# EAGLE board sam9g25 (EAGLE 7.2.0)
SAM9G25 Embedded Linux Board Copyright (C) 2015 Andreas Auer (aauer1@emicrotec.at) This program is free software; you can redistribute it and/or modify it under the terms of the GNU General Public License as published by the Free Software Foundation; either version 2 of the License, or (at your option) any later version. This program is distributed in the hope that it will be useful, but WITHOUT ANY WARRANTY; without even the implied warranty of MERCHANTABILITY or FITNESS FOR A PARTICULAR PURPOSE. See the GNU General Public License for more details. You should have received a copy of the GNU General Public License along with this program; if not, write to the Free Software Foundation, Inc., 51 Franklin Street, Fifth Floor, Boston, MA 02110-1301 USA.
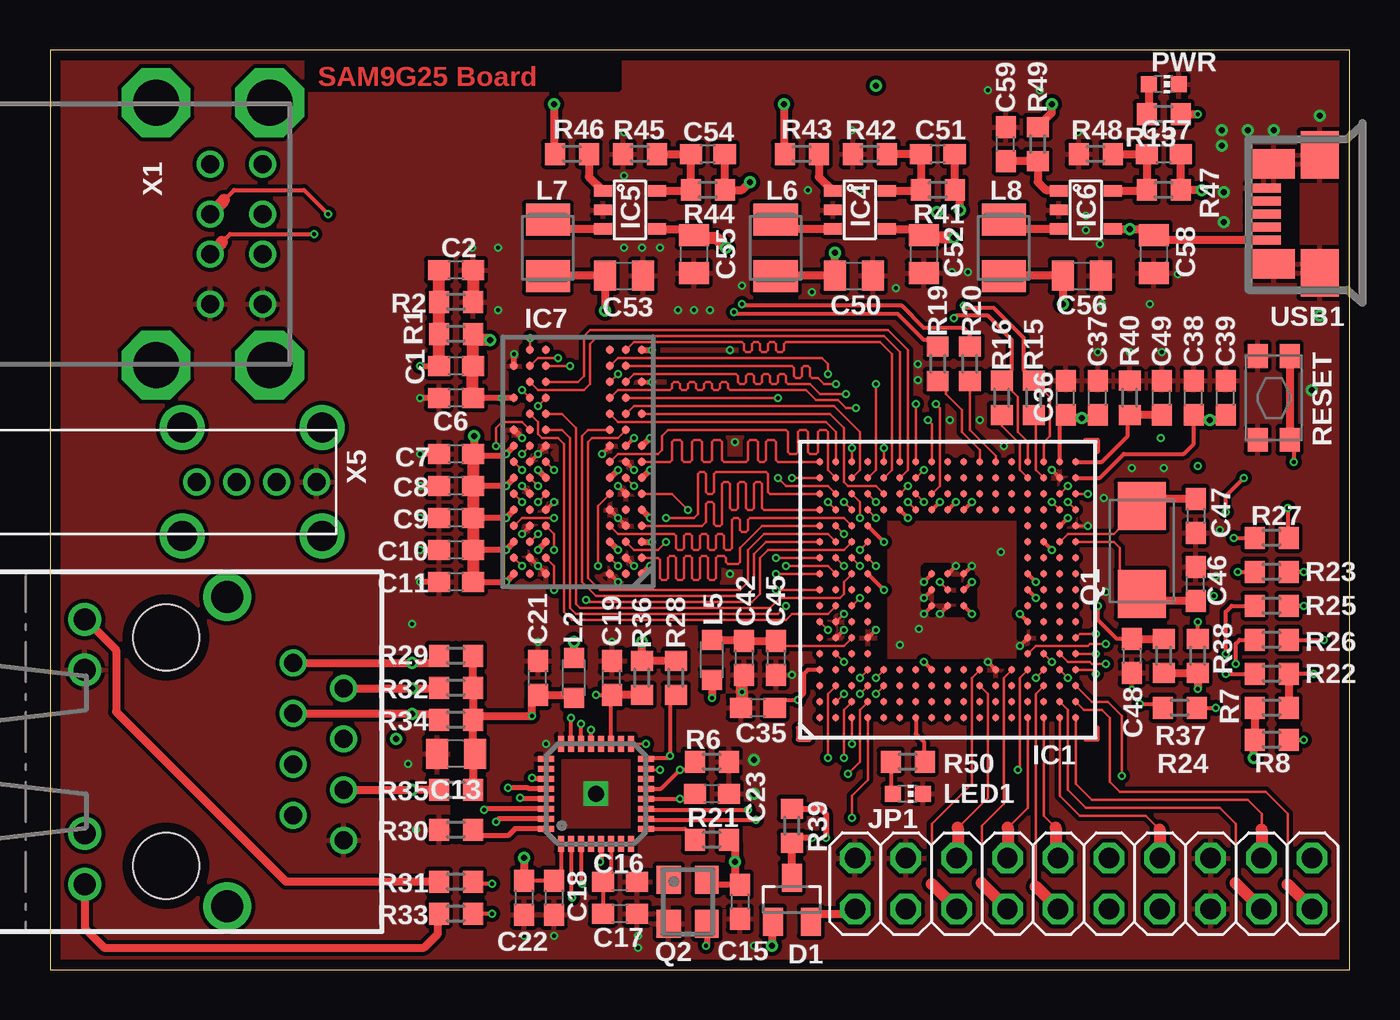
[diagram p3: board, top side]
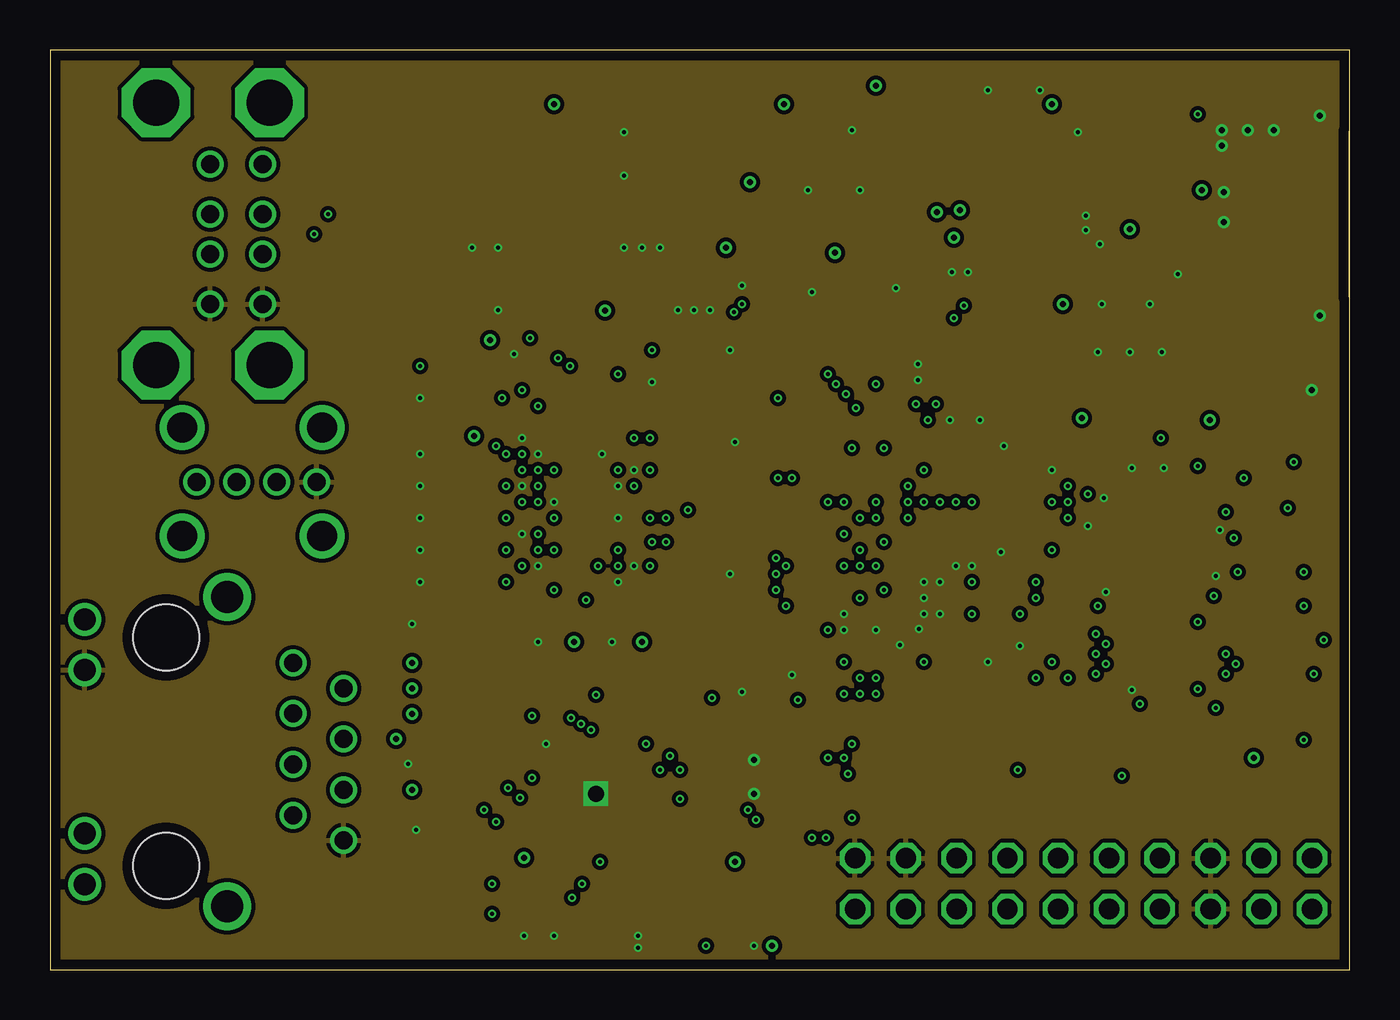
[diagram p4: board, inner layer Route2]
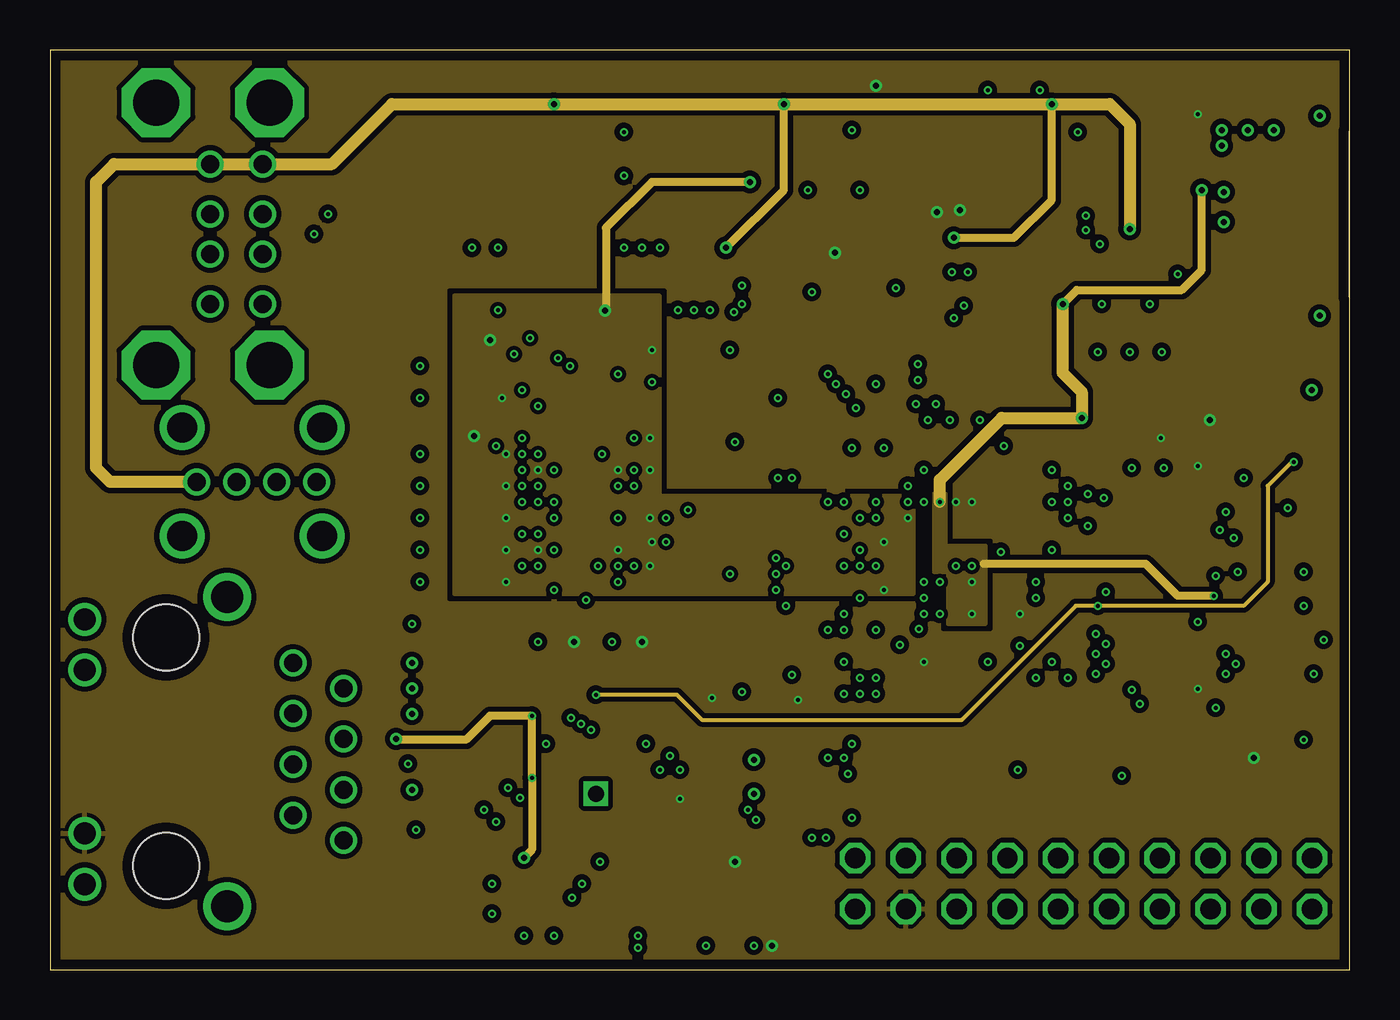
[diagram p5: board, inner layer Route15]
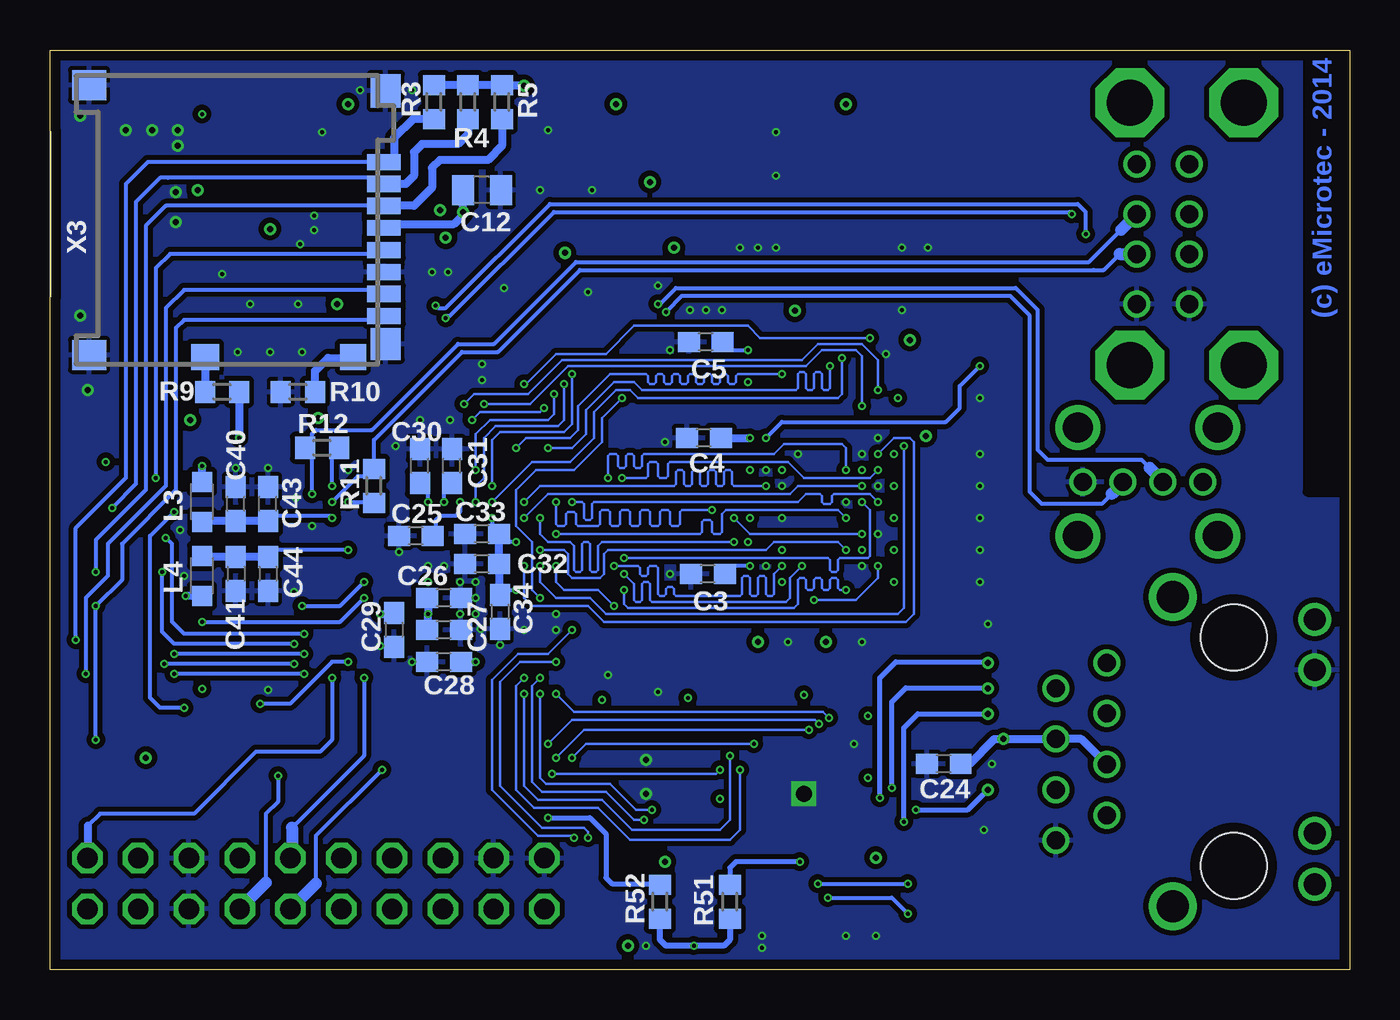
[diagram p6: board, bottom side, seen from below]

Size 65 x 46 mm. Coordinates in mm from the lower left corner, seen from the top.
Outline: 0,0 65,0 65,46 0,46 0,0
Copper layers (1+(2*15)+16): Top 0.035mm / dielectric 0.4mm / Route2 0.035mm / dielectric 0.7mm / Route15 0.035mm / dielectric 0.4mm / Bottom 0.035mm
Design rules "my_multi-cb_035um-cu *": minimum track width 0.125mm, minimum drill 0.2mm, track to track 0.125mm, track to pad 0.125mm, pad to pad 0.125mm, via to via 0.125mm, smd to smd 0.1mm, copper to edge 20mil, drill to drill 8mil, minimum pad ring 8mil, minimum via ring 0.1mm, stop-mask expansion 0.75mm, vias tented up to drill 0.2mm, thermal gap 8mil
tRestrict: 41 lines
bRestrict: 6 lines

## Footprints (pad centres in the part's own frame; a part is rotated, then mirrored left to right if it is on the bottom)
C0603 = smd 1.1 x 1: 1 -0.85,0; 2 0.85,0
C0805 = smd 1.1 x 1.5: 1 -0.95,0; 2 0.95,0
SOT23 = smd 1 x 1.4: 1 -0.95,-1.1; 2 0.95,-1.1; 3 0,1.1
LFBGA217 = smd 0.34 x 0.34: A1 -6.4,6.4; A2 -5.6,6.4; A3 -4.8,6.4; A4 -4,6.4; A5 -3.2,6.4; A6 -2.4,6.4; A7 -1.6,6.4; A8 -0.8,6.4; A9 0,6.4; A10 0.8,6.4; A11 1.6,6.4; A12 2.4,6.4; A13 3.2,6.4; A14 4,6.4; A15 4.8,6.4; A16 5.6,6.4; A17 6.4,6.4; B1 -6.4,5.6; B2 -5.6,5.6; B3 -4.8,5.6; B4 -4,5.6; B5 -3.2,5.6; B6 -2.4,5.6; B7 -1.6,5.6; B8 -0.8,5.6; B9 0,5.6; B10 0.8,5.6; B11 1.6,5.6; B12 2.4,5.6; B13 3.2,5.6; B14 4,5.6; B15 4.8,5.6; B16 5.6,5.6; B17 6.4,5.6; C1 -6.4,4.8; C2 -5.6,4.8; C3 -4.8,4.8; C4 -4,4.8; C5 -3.2,4.8; C6 -2.4,4.8; C7 -1.6,4.8; C8 -0.8,4.8; C9 0,4.8; C10 0.8,4.8; C11 1.6,4.8; C12 2.4,4.8; C13 3.2,4.8; C14 4,4.8; C15 4.8,4.8; C16 5.6,4.8; C17 6.4,4.8; D1 -6.4,4; D2 -5.6,4; D3 -4.8,4; D4 -4,4; D5 -3.2,4; D6 -2.4,4; D7 -1.6,4; D8 -0.8,4; D9 0,4; D10 0.8,4; D11 1.6,4; D12 2.4,4; D13 3.2,4; D14 4,4; D15 4.8,4; D16 5.6,4; D17 6.4,4; E1 -6.4,3.2; E2 -5.6,3.2; E3 -4.8,3.2; E4 -4,3.2; E14 4,3.2; E15 4.8,3.2; E16 5.6,3.2; E17 6.4,3.2; F1 -6.4,2.4; F2 -5.6,2.4; F3 -4.8,2.4; F4 -4,2.4; F14 4,2.4; F15 4.8,2.4; F16 5.6,2.4; F17 6.4,2.4; G1 -6.4,1.6; G2 -5.6,1.6; G3 -4.8,1.6; G4 -4,1.6; G14 4,1.6; G15 4.8,1.6; G16 5.6,1.6; G17 6.4,1.6; H1 -6.4,0.8; H2 -5.6,0.8; H3 -4.8,0.8; H4 -4,0.8; H8 -0.8,0.8; H9 0,0.8; H10 0.8,0.8; H14 4,0.8; H15 4.8,0.8; H16 5.6,0.8; H17 6.4,0.8; J1 -6.4,0; J2 -5.6,0; J3 -4.8,0; J4 -4,0; J8 -0.8,0; J9 0,0; J10 0.8,0; J14 4,0; J15 4.8,0; J16 5.6,0; J17 6.4,0; K1 -6.4,-0.8; K2 -5.6,-0.8; K3 -4.8,-0.8; K4 -4,-0.8; K8 -0.8,-0.8; K9 0,-0.8; K10 0.8,-0.8; K14 4,-0.8; K15 4.8,-0.8; K16 5.6,-0.8; K17 6.4,-0.8; L1 -6.4,-1.6; L2 -5.6,-1.6; L3 -4.8,-1.6; L4 -4,-1.6; L14 4,-1.6; L15 4.8,-1.6; L16 5.6,-1.6; L17 6.4,-1.6; M1 -6.4,-2.4; M2 -5.6,-2.4; M3 -4.8,-2.4; M4 -4,-2.4; M14 4,-2.4; M15 4.8,-2.4; M16 5.6,-2.4; M17 6.4,-2.4; N1 -6.4,-3.2; N2 -5.6,-3.2; N3 -4.8,-3.2; N4 -4,-3.2; N14 4,-3.2; N15 4.8,-3.2; N16 5.6,-3.2; N17 6.4,-3.2; P1 -6.4,-4; P2 -5.6,-4; P3 -4.8,-4; P4 -4,-4; P5 -3.2,-4; P6 -2.4,-4; P7 -1.6,-4; P8 -0.8,-4; P9 0,-4; P10 0.8,-4; P11 1.6,-4; P12 2.4,-4; P13 3.2,-4; P14 4,-4; P15 4.8,-4; P16 5.6,-4; P17 6.4,-4; R1 -6.4,-4.8; R2 -5.6,-4.8; R3 -4.8,-4.8; R4 -4,-4.8; R5 -3.2,-4.8; R6 -2.4,-4.8; R7 -1.6,-4.8; R8 -0.8,-4.8; R9 0,-4.8; R10 0.8,-4.8; R11 1.6,-4.8; R12 2.4,-4.8; R13 3.2,-4.8; R14 4,-4.8; R15 4.8,-4.8; R16 5.6,-4.8; R17 6.4,-4.8; T1 -6.4,-5.6; T2 -5.6,-5.6; T3 -4.8,-5.6; T4 -4,-5.6; T5 -3.2,-5.6; T6 -2.4,-5.6; T7 -1.6,-5.6; T8 -0.8,-5.6; T9 0,-5.6; T10 0.8,-5.6; T11 1.6,-5.6; T12 2.4,-5.6; T13 3.2,-5.6; T14 4,-5.6; T15 4.8,-5.6; T16 5.6,-5.6; T17 6.4,-5.6; U1 -6.4,-6.4; U2 -5.6,-6.4; U3 -4.8,-6.4; U4 -4,-6.4; U5 -3.2,-6.4; U6 -2.4,-6.4; U7 -1.6,-6.4; U8 -0.8,-6.4; U9 0,-6.4; U10 0.8,-6.4; U11 1.6,-6.4; U12 2.4,-6.4; U13 3.2,-6.4; U14 4,-6.4; U15 4.8,-6.4; U16 5.6,-6.4; U17 6.4,-6.4
QFN32 = smd 0.8 x 0.3: 1 -2.5,1.75; 2 -2.5,1.25; 3 -2.5,0.75; 4 -2.5,0.25; 5 -2.5,-0.25; 6 -2.5,-0.75; 7 -2.5,-1.25; 8 -2.5,-1.75; 17 2.5,-1.75; 18 2.5,-1.25; 19 2.5,-0.75; 20 2.5,-0.25; 21 2.5,0.25; 22 2.5,0.75; 23 2.5,1.25; 24 2.5,1.75 | smd 0.3 x 0.8: 9 -1.75,-2.5; 10 -1.25,-2.5; 11 -0.75,-2.5; 12 -0.25,-2.5; 13 0.25,-2.5; 14 0.75,-2.5; 15 1.25,-2.5; 16 1.75,-2.5; 25 1.75,2.5; 26 1.25,2.5; 27 0.75,2.5; 28 0.25,2.5; 29 -0.25,2.5; 30 -0.75,2.5; 31 -1.25,2.5; 32 -1.75,2.5 | drill 0.8 square: EXPOSED 0,0
SOT23-5 = smd 0.55 x 0.9: 1 -0.95,-1.35; 2 0,-1.35; 3 0.95,-1.35; 4 0.95,1.35; 5 -0.95,1.35
FBGA84 = smd 0.4 x 0.4: A1 -3.2,5.6; A2 -2.4,5.6; A3 -1.6,5.6; A7 1.6,5.6; A8 2.4,5.6; A9 3.2,5.6; B1 -3.2,4.8; B2 -2.4,4.8; B3 -1.6,4.8; B7 1.6,4.8; B8 2.4,4.8; B9 3.2,4.8; C1 -3.2,4; C2 -2.4,4; C3 -1.6,4; C7 1.6,4; C8 2.4,4; C9 3.2,4; D1 -3.2,3.2; D2 -2.4,3.2; D3 -1.6,3.2; D7 1.6,3.2; D8 2.4,3.2; D9 3.2,3.2; E1 -3.2,2.4; E2 -2.4,2.4; E3 -1.6,2.4; E7 1.6,2.4; E8 2.4,2.4; E9 3.2,2.4; F1 -3.2,1.6; F2 -2.4,1.6; F3 -1.6,1.6; F7 1.6,1.6; F8 2.4,1.6; F9 3.2,1.6; G1 -3.2,0.8; G2 -2.4,0.8; G3 -1.6,0.8; G7 1.6,0.8; G8 2.4,0.8; G9 3.2,0.8; H1 -3.2,0; H2 -2.4,0; H3 -1.6,0; H7 1.6,0; H8 2.4,0; H9 3.2,0; J1 -3.2,-0.8; J2 -2.4,-0.8; J3 -1.6,-0.8; J7 1.6,-0.8; J8 2.4,-0.8; J9 3.2,-0.8; K2 -2.4,-1.6; K3 -1.6,-1.6; K7 1.6,-1.6; K8 2.4,-1.6; K9 3.2,-1.6; L1 -3.2,-2.4; L2 -2.4,-2.4; L3 -1.6,-2.4; L7 1.6,-2.4; L8 2.4,-2.4; M2 -2.4,-3.2; M3 -1.6,-3.2; M7 1.6,-3.2; M8 2.4,-3.2; M9 3.2,-3.2; N1 -3.2,-4; N2 -2.4,-4; N3 -1.6,-4; N7 1.6,-4; N8 2.4,-4; P2 -2.4,-4.8; P3 -1.6,-4.8; P7 1.6,-4.8; P8 2.4,-4.8; P9 3.2,-4.8; R1 -3.2,-5.6; R2 -2.4,-5.6; R3 -1.6,-5.6; R7 1.6,-5.6; R8 2.4,-5.6
2X10 = drill 1.016 octagon: 1 -11.43,-1.27; 2 -11.43,1.27; 3 -8.89,-1.27; 4 -8.89,1.27; 5 -6.35,-1.27; 6 -6.35,1.27; 7 -3.81,-1.27; 8 -3.81,1.27; 9 -1.27,-1.27; 10 -1.27,1.27; 11 1.27,-1.27; 12 1.27,1.27; 13 3.81,-1.27; 14 3.81,1.27; 15 6.35,-1.27; 16 6.35,1.27; 17 8.89,-1.27; 18 8.89,1.27; 19 11.43,-1.27; 20 11.43,1.27
L2012C = smd 1 x 1: 1 -1,0; 2 1,0
L3230M = smd 1.6 x 2.2: 1 -1.4,0; 2 1.4,0
CHIP-LED0603 = smd 0.8 x 0.8: A 0,-0.75; C 0,0.75
SMD5032 = smd 2.4 x 2.4: 1 -2.2,0; 2 2.2,0
DFN4 = smd 1.4 x 1.2: 1 -1.1,-0.95; 2 1.1,-0.95; 3 1.1,0.95; 4 -1.1,0.95
R0603 = smd 1 x 1.1: 1 -0.85,0; 2 0.85,0
KMR4 = smd 1.2 x 1: 1 2.1,0.8; 2 2.1,-0.8; 3 -2.1,0.8; 4 -2.1,-0.8
MOLEX-47364-0001 = smd 1.7 x 0.45: 1 2.8,1.3; 2 2.8,0.65; 3 2.8,0; 4 2.8,-0.65; 5 2.8,-1.3 | smd 1.9 x 2.375: GND1 0,2.95; GND4 0,-2.95 | smd 2.1 x 1.475: GND2 2.3,2.5; GND3 2.3,-2.5
USB-DOUBLE-FCI = drill 0.9: A1 -3.5,5.33; A2 -1,5.33; A3 1,5.33; A4 3.5,5.33; B1 -3.5,2.71; B2 -1,2.71; B3 1,2.71; B4 3.5,2.71 | drill 2.3 octagon: P$1 6.57,0; P$2 -6.57,0; P$3 6.57,5.68; P$4 -6.57,5.68
MOLEX-MICRO-SD = smd 0.8 x 1.68: 1 8.9,-15.6; 2 7.8,-15.6; 3 6.7,-15.6; 4 5.6,-15.6; 5 4.5,-15.6; 6 3.4,-15.6; 7 2.3,-15.6; 8 1.2,-15.6 | smd 1.5 x 1.7: SHIELD@1 -0.75,-0.85; SHIELD@2 12.75,-0.85 | smd 1.7 x 1.5: SHIELD@3 12.45,-15.7 | smd 1.6 x 1.5: SHIELD@4 -0.2,-15.7 | smd 1.3 x 1.3: SW1 -0.86,-14.05 | smd 1.3 x 1.4: SW2 -0.86,-6.65
HFJ11_LED = drill 0.9: 1 -4.445,6.35; 2 -3.175,8.89; 3 -1.905,6.35; 4 -0.635,8.89; 5 0.635,6.35; 6 1.905,8.89; 7 3.175,6.35; 8 4.445,8.89 | drill 1.1: A1 -6.625,-4.06; A2 4.085,-4.06; K1 -4.085,-4.06; K2 6.625,-4.06 | drill 1.6: P$1 -7.745,3.05; P$2 7.745,3.05 | hole 3.3: -5.715,0; 5.715,0
USB-A-HU = drill 0.9: D+ 4.73,0; D- 2.73,0; GND 6.73,0; VBUS 0.73,0 | drill 1.5: P$5 0,2.72; P$6 0,-2.72; P$7 7,2.72; P$8 7,-2.72

## Placement (x,y rotation side)
C1  100n  [C0603]  20.3,30.2 180 top
C2  100n  [C0603]  20.3,35 0 top
C3  100n  [C0603]  32.1,19.8 180 bottom
C4  100n  [C0603]  32.3,26.6 180 bottom
C5  100n  [C0603]  32.2,31.4 180 bottom
C6  100n  [C0603]  20.3,28.6 180 top
C7  100n  [C0603]  20.3,25.8 180 top
C8  100n  [C0603]  20.3,24.2 180 top
C9  100n  [C0603]  20.3,22.6 180 top
C10  100n  [C0603]  20.3,21 180 top
C11  100n  [C0603]  20.3,19.4 180 top
C12  22u/6.3V  [C0805]  43.4,39 180 bottom
C13  22u/6.3V  [C0805]  20.3,10.8 180 top
C15  1u  [C0603]  34.5,3.4 270 top
C16  1u  [C0603]  28.5,4.4 0 top
C17  470p  [C0603]  28.5,2.8 0 top
C18  100n  [C0603]  25.2,3.6 270 top
C19  100n  [C0603]  28.1,14.6 90 top
C21  100n  [C0603]  24.4,14.6 90 top
C22  2u2  [C0603]  23.7,3.6 270 top
C23  100n  [C0603]  33.1,8.8 0 top
C24  100n  [C0603]  20.3,10.3 180 bottom
C25  100n  [C0603]  46.7,21.7 180 bottom
C26  100n  [C0603]  45.3,18.6 0 bottom
C27  100n  [C0603]  45.3,17 0 bottom
C28  100n  [C0603]  45.3,15.4 180 bottom
C29  100n  [C0603]  47.8,17 270 bottom
C30  100n  [C0603]  46.5,25.2 90 bottom
C31  100n  [C0603]  44.9,25.2 90 bottom
C32  100n  [C0603]  43.4,20.3 180 bottom
C33  100n  [C0603]  43.4,21.8 180 bottom
C34  100n  [C0603]  42.5,17.9 270 bottom
C35  100n  [C0603]  35.4,13.1 180 top
C36  4u7  [C0603]  50.8,28.6 90 top
C37  100n  [C0603]  52.4,28.6 90 top
C38  4u7  [C0603]  57.2,28.6 90 top
C39  100n  [C0603]  58.8,28.6 90 top
C40  4u7  [C0603]  55.7,23.3 90 bottom
C41  4u7  [C0603]  55.7,19.8 270 bottom
C42  4u7  [C0603]  34.7,15.6 270 top
C43  100n  [C0603]  54.1,23.3 90 bottom
C44  100n  [C0603]  54.1,19.8 270 bottom
C45  100n  [C0603]  36.3,15.6 270 top
C46  27p  [C0603]  57.3,19.3 90 top
C47  27p  [C0603]  57.3,22.7 270 top
C48  10n  [C0603]  54.1,15.7 270 top
C49  10p  [C0603]  55.6,28.6 90 top
C50  22u/6V3  [C0805]  40.2,34.7 0 top
C51  15p  [C0603]  44.4,40.8 180 top
C52  10u/6V3  [C0805]  43.7,35.8 270 top
C53  22u/6V3  [C0805]  28.7,34.7 0 top
C54  15p  [C0603]  32.9,40.8 180 top
C55  10u/6V3  [C0805]  32.2,35.8 270 top
C56  22u/6V3  [C0805]  51.6,34.7 0 top
C57  15p  [C0603]  55.7,40.8 180 top
C58  10u/6V3  [C0805]  55.2,35.8 270 top
C59  100n  [C0603]  47.8,41.3 90 top
D1  BAT54C  [SOT23]  37.1,3.5 0 top
IC1  AT91SAM9G25  [LFBGA217]  44.9,19 90 top
IC3  LAN8710  [QFN32]  27.3,8.8 90 top
IC4  NCP1529  [SOT23-5]  40.5,38 270 top
IC5  NCP1529  [SOT23-5]  29,38 270 top
IC6  NCP1529  [SOT23-5]  51.8,38 270 top
IC7  H5PSXG63JFR  [FBGA84]  26.4,25.4 180 top
JP1  [2X10]  51.7,4.3 0 top
L2  FB0805/600R/200mA  [L2012C]  26.2,14.6 90 top
L3  10u  [L2012C]  57.4,23.4 90 bottom
L4  10u  [L2012C]  57.4,19.7 270 bottom
L5  220n  [L2012C]  33.1,15.5 270 top
L6  2u2  [L3230M]  36.3,36.1 270 top
L7  2u2  [L3230M]  24.9,36.1 270 top
L8  2u2  [L3230M]  47.7,36.1 270 top
LED1  [CHIP-LED0603]  42.9,8.8 270 top
PWR  [CHIP-LED0603]  55.7,44.3 270 top
Q1  12MHz  [SMD5032]  54.6,21 90 top
Q2  SI50X  [DFN4]  31.9,3.4 270 top
R1  1k  [R0603]  20.3,31.8 0 top
R2  1k  [R0603]  20.3,33.4 180 top
R3  100k  [R0603]  45.8,43.4 90 bottom
R4  100k  [R0603]  44.1,43.4 90 bottom
R5  10k  [R0603]  42.4,43.4 90 bottom
R6  10k  [R0603]  33.1,10.4 180 top
R7  100k  [R0603]  61.1,13.1 180 top
R8  100k  [R0603]  61.1,11.5 180 top
R9  100k  [R0603]  56.4,28.9 0 bottom
R10  10k  [R0603]  52.6,28.9 180 bottom
R11  39  [R0603]  48.8,24.2 90 bottom
R12  39  [R0603]  51.4,26.1 180 bottom
R13  1k  [R0603]  55.7,42.8 180 top
R15  39  [R0603]  49.2,28.6 90 top
R16  39  [R0603]  47.6,28.6 90 top
R19  27  [R0603]  44.4,30.3 90 top
R20  27  [R0603]  46,30.3 90 top
R21  10k  [R0603]  33.1,6.5 180 top
R22  27  [R0603]  61.1,14.8 0 top
R23  27  [R0603]  61.1,19.9 0 top
R24  27  [R0603]  56.5,13.1 0 top
R25  27  [R0603]  61.1,18.2 0 top
R26  27  [R0603]  61.1,16.5 0 top
R27  27  [R0603]  61.1,21.6 0 top
R28  4k7  [R0603]  31.3,14.6 90 top
R29  49R9  [R0603]  20.3,15.7 0 top
R30  12k1  [R0603]  20.3,7 180 top
R31  150R  [R0603]  20.3,4.4 180 top
R32  49R9  [R0603]  20.3,14.1 0 top
R33  150R  [R0603]  20.3,2.8 180 top
R34  49R9  [R0603]  20.3,12.5 0 top
R35  49R9  [R0603]  20.3,9 0 top
R36  10k  [R0603]  29.6,14.6 90 top
R37  10k  [R0603]  55.7,15.7 270 top
R38  100k  [R0603]  57.4,15.7 270 top
R39  100k  [R0603]  37.1,7.2 90 top
R40  6k8 1%  [R0603]  54,28.6 270 top
R41  680k  [R0603]  44.4,39 0 top
R42  150k  [R0603]  41,40.8 0 top
R43  10k  [R0603]  37.6,40.8 180 top
R44  200k  [R0603]  32.9,39 0 top
R45  100k  [R0603]  29.5,40.8 0 top
R46  10k  [R0603]  26.1,40.8 180 top
R47  147k  [R0603]  55.7,39 0 top
R48  200k  [R0603]  52.3,40.8 0 top
R49  10k  [R0603]  49.4,41.3 90 top
R50  470R  [R0603]  42.9,10.4 180 top
R51  27  [R0603]  31,3.4 90 bottom
R52  27  [R0603]  34.5,3.4 270 bottom
RESET  KMR4  [KMR4]  61.2,28.6 270 top
USB1  MOLEX-47346-0001  [MOLEX-47364-0001]  63.5,37.8 180 top
X1  [USB-DOUBLE-FCI]  5.3,36.8 270 top
X3  MICRO-SD_MOLEX-502774-001  [MOLEX-MICRO-SD]  63.9,31.5 90 bottom
X4  HFJ11-2450E  [HFJ11_LED]  5.8,10.9 270 top
X5  USB-A-HU  [USB-A-HU]  6.6,24.4 0 top

## Tracks (layer width: path | path; a pad name or v marks a point on that pad's centre or on a via)
#SDCK  (via drill 0.2)
  Top 0.125: IC7.K8 23.6,27.4 22.6,27.4 22.3,27.1 v22.3,26.2 | IC1.C11 v40.5,20.2
  Bottom 0.125: v22.3,26.2 22.3,18.1 22.6,17.8 37.2,17.8 38,18.6 39.7,18.6 40.5,19.4 v40.5,20.2
+1V8  (via drill 0.2, 0.3 pad 0.6)
  Top 0.2: v22.8,25.8 22.7,25.7 | 21.3,25.7 21.2,25.8 C7.1 | IC1.D10 v41.7,19 | IC1.D13 v41.7,21.4 | IC1.F14 v42.9,22.6
  Top 0.305: IC7.C7 v24.4,21 | IC7.C9 v22.8,21 C10.1 | IC7.A9 v22.8,19.4 C11.1 | IC7.E9 v22.8,22.6 C9.1 | IC7.G9 v22.8,24.2 C8.1 | IC7.M9 v22.6,28.6 C6.1 | IC7.J9 v22.8,25.8 | IC7.G7 v24.4,25 | IC7.R1 v30.1,31 | IC7.J1 v30,26.6 | IC7.G1 v30,25 | IC7.G3 v28.4,25 | IC7.E1 v30,22.6 | IC7.C1 v30.1,21.4 | IC7.A1 v30,20.2 | IC7.C3 v28.4,21 | 22.7,25.7 21.3,25.7
  Top 0.406: L7.2 C53.1 v27.75,32.95 | C54.1 R44.2 34.6,39 v35,39.4 | 21.1,19.35 C11.1 | v21.2,26.7 21.2,25.8
  Top 0.61: v22,31.5 21.4,31.5 21.3,31.6 21.15,31.6 | C1.1 21.15,31.6 | 21.15,31.6 R1.2 | 21.1,30 21.1,28.9 21.15,28.9 C6.1 | C7.1 C11.1
  Route15 0.406: v35,39.4 30.1,39.4 27.8,37.1 27.8,33 v27.75,32.95
  Bottom 0.2: v30,20.2 30.85,20.2 C3.1 | C5.1 31.35,31.05 31.3,31 v30.1,31 | C34.1 42.5,19 v41.7,19 | v41.7,21.4 42.55,21.4 C33.1 | v42.9,22.6 42.9,22.1
  Bottom 0.406: C32.1 42.55,18.75 C34.1 | C4.1 v30,26.6 | 42.55,20.4 C33.1
  pour Route15 (isolate 0.2): 20.2,33.7 20.2,18.8 43.2,18.8 43.2,23.7 30.5,23.7 30.5,33.7
+3V3  (via drill 0.2, 0.3 pad 0.6)
  Top 0.2: IC1.H4 v43.7,15.4 | IC1.J14 v45.3,23.4 | IC1.K14 v46.1,23.4 | IC1.P7 v48.5,17.8 | IC3.12 v31.5,8.55 32,8.55 C23.1 | IC1.U16 52.5,24.6 53.7,25.8 56.7,25.8 57.2,26.3 C38.1 | IC1.A4 37.9,15 37.7,14.8 37.7,13.8 v37.4,13.5 36.6,13.5 36.6,13.3 36.45,13.3 C35.1
  Top 0.305: C15.1 33.1,4.25 Q2.4
  Top 0.406: L5.2 v33.1,13.6 | R28.2 R36.2 v29.6,16.4 | L2.2 v26.2,16.4 | L6.2 C50.1 v39.25,35.85 | v45.5,38 45.5,38.6 45.2,38.9 45.2,38.95 R41.2 C51.1 | R21.1 34.1,6.5 34.25,6.35 v34.25,5.4 34.25,4.5 C15.1 | R7.2 R8.2 60.2,11.45 v60.2,10.6 | R37.2 R38.2 v57.4,14.05 | C39.1 58.55,27.5 v58,27.5 57.2,27.5 C38.1 | D1.1 36.1,2.4 v36.1,1.2 | R13.1 v57.4,42.8
  Bottom 0.2: v45.3,23.4 45.3,24.35 C31.1 | v46.1,23.4 46.1,24.35 C30.1 | 47.85,17.8 C29.1
  Bottom 0.406: X3.4 48,37.1 47.8,37.3 44.8,37.3 44.35,37.75 v44.35,37.9 C12.2 | L3.2 v57.4,25.2 | R9.2 v55.55,26.6 | v48.5,17.8 47.85,17.8 | C28.1 v43.7,15.4 | R5.2 42.35,44.3 | R5.2 R4.2 R3.2 | v41.3,44.2 42.35,44.2 R5.2
  pour Route15 (isolate 0.254, rank 6): -15,63 -15,-15 80,-15 80,63
+5V  (via drill 0.3 pad 0.6)
  Top 0.406: IC6.4 v54,37.05 54.9,37.05 C58.1 55.35,36.6 55.4,36.6 55.5,36.5 USB1.1 | IC4.4 43.4,37.05 C52.1 | IC5.4 31.9,37.05 C55.1 | v36.7,43.3 36.7,40.85 R43.2 | v25.2,43.3 25.2,40.85 R46.2 | R49.2 50.1,42.85 v50.1,43.3
  Top 0.61: C55.1 32.2,36.6 33.3,36.6 v33.8,36.1 | v45.2,36.6 43.85,36.6 C52.1
  Route15 0.406: v45.2,36.6 48.2,36.6 50.1,38.5 v50.1,43.3 | v33.8,36.1 36.7,39 v36.7,43.3
  Route15 0.61: v54,37.05 54,42.3 53,43.3 v50.1,43.3 v36.7,43.3 v25.2,43.3 17.1,43.3 14.1,40.3 X1.A1 X1.B1 3.2,40.3 2.3,39.4 2.3,25.1 3,24.4 X5.VBUS
A2  (via drill 0.2)
  Top 0.125: IC1.H15 44.5,24.2 44.5,28.1 v44.3,28.3 | IC7.M8 v23.6,29
  Bottom 0.125: v23.6,29 23.6,30.5 24.4,31.3 26.6,31.3 27.4,30.5 39.4,30.5 41.1,28.8 43.8,28.8 v44.3,28.3
A3  (via drill 0.2)
  Top 0.125: IC7.M3 28.4,29 31,29 31.1,29.1 31.1,29.3 31.2,29.4 31.4,29.4 31.5,29.3 31.5,29.1 31.6,29 31.8,29 31.9,29.1 31.9,29.3 32,29.4 32.2,29.4 32.3,29.3 32.3,29.1 32.4,29 32.6,29 32.7,29.1 32.7,29.3 32.8,29.4 33,29.4 33.1,29.3 33.1,29.1 33.2,29 33.4,29 33.5,29.1 33.5,29.3 33.6,29.4 33.8,29.4 33.9,29.3 33.9,29.1 34,29 37.8,29 38.3,28.5 39.4,28.5 39.8,28.1 v40.3,28.1 | IC1.H17 44.1,27.3 v43.9,27.5
  Bottom 0.125: v40.3,28.1 40.5,27.9 43.5,27.9 v43.9,27.5
A4  (via drill 0.2)
  Top 0.125: IC7.M7 v24.4,28.2 | v43.3,28.3 IC1.G17
  Bottom 0.125: v24.4,28.2 24.4,30.7 24.7,31 26.4,31 27.2,30.2 39.1,30.2 41,28.3 v43.3,28.3
A5  (via drill 0.2)
  Top 0.125: IC7.N2 29.2,29.8 34.3,29.8 34.4,29.7 34.4,29.4 34.5,29.3 34.7,29.3 34.8,29.4 34.8,29.7 34.9,29.8 35.1,29.8 35.2,29.7 35.2,29.4 35.3,29.3 35.5,29.3 35.6,29.4 35.6,29.7 35.7,29.8 35.9,29.8 36,29.7 36,29.4 36.1,29.3 36.3,29.3 36.4,29.4 36.4,29.7 36.5,29.8 36.7,29.8 36.8,29.7 36.8,29.4 36.9,29.3 38,29.3 38.5,28.8 v39.8,28.8 | IC1.G16 v43.7,25
  Bottom 0.125: v39.8,28.8 39.8,27.8 40.1,27.5 43,27.5 43.7,26.8 v43.7,25
A6
  Top 0.125: IC7.N8 24.4,29 26.7,29 27,29.3 27,31.3 27.4,31.7 41.7,31.7 42.5,30.9 IC1.F17
A7  (via drill 0.2)
  Top 0.125: IC7.N3 v28.4,29.8 | v41.7,26.1 IC1.E17
  Bottom 0.125: v28.4,29.8 30.6,29.8 30.7,29.7 30.7,29.4 30.8,29.3 31,29.3 31.1,29.4 31.1,29.7 31.2,29.8 31.4,29.8 31.5,29.7 31.5,29.4 31.6,29.3 31.8,29.3 31.9,29.4 31.9,29.7 32,29.8 32.2,29.8 32.3,29.7 32.3,29.4 32.4,29.3 32.6,29.3 32.7,29.4 32.7,29.7 32.8,29.8 33,29.8 33.1,29.7 33.1,29.4 33.2,29.3 33.4,29.3 33.5,29.4 33.5,29.7 33.6,29.8 33.8,29.8 33.9,29.7 33.9,29.4 34,29.3 34.2,29.3 34.3,29.4 34.3,29.7 34.4,29.8 34.6,29.8 34.7,29.7 34.7,29.4 34.8,29.3 35,29.3 35.1,29.4 35.1,29.7 35.2,29.8 37,29.8 38.6,28.2 38.6,27 39,26.6 41.2,26.6 v41.7,26.1
A8
  Top 0.125: IC1.F16 42.9,25 42.9,31 41.9,32 27,32 26.7,31.7 26.7,29.7 26.4,29.4 IC7.N7
A9  (via drill 0.2)
  Top 0.125: IC7.P2 37.1,30.2 37.2,30.1 37.2,29.7 37.3,29.6 37.5,29.6 37.6,29.7 37.6,30.1 37.7,30.2 37.9,30.2 38,30.1 38,29.7 38.1,29.6 38.4,29.6 38.7,29.3 v39.3,29.3 | v43.7,23.4 IC1.G15
  Bottom 0.125: v39.3,29.3 39.3,27.5 39.6,27.2 42.7,27.2 43.3,26.6 43.3,24.6 43.7,24.2 v43.7,23.4
A10  (via drill 0.2)
  Top 0.125: IC7.P8 24.4,30.6 v25.4,30.6 | v42.9,23.4 IC1.G14
  Bottom 0.125: v25.4,30.6 25.4,28.8 25.6,28.6 35.6,28.6 36,29 36.7,29 37.8,27.9 37.8,26.6 39,25.4 40.9,25.4 v42.9,23.4
A11  (via drill 0.2)
  Top 0.125: IC7.P3 28.4,30.6 38.6,30.6 38.9,30.3 v38.9,29.8 | v42.9,24.2 IC1.F15
  Bottom 0.125: v38.9,29.8 38.9,27.9 38.9,27.3 39.3,26.9 39.9,26.9 42.5,26.9 42.9,26.5 v42.9,24.2
A13  (via drill 0.2)
  Top 0.125: IC7.P7 v26,30.2 | IC1.C17 v40.1,26.1
  Bottom 0.125: v40.1,26.1 38.9,26.1 38.2,26.8 38.2,28 36.8,29.4 35.8,29.4 35.4,29 27.7,29 27.6,29.1 27.6,29.8 27.5,29.9 27.3,29.9 27.2,29.8 27.2,29.1 27.1,29 26.9,29 26.8,29.1 26.8,29.8 26.7,29.9 26.5,29.9 26.4,29.8 26.4,29.1 26.3,29 26.1,29 26,29.1 v26,30.2
A14
  Top 0.125: IC7.R2 29.2,31.4 34.6,31.4 34.7,31.3 34.7,31 34.8,30.9 35,30.9 35.1,31 35.1,31.3 35.2,31.4 35.4,31.4 35.5,31.3 35.5,31 35.6,30.9 35.8,30.9 35.9,31 35.9,31.3 36,31.4 36.2,31.4 36.3,31.3 36.3,31 36.4,30.9 36.6,30.9 36.7,31 36.7,31.3 36.8,31.4 41.5,31.4 42.1,30.8 42.1,25 IC1.E16
A15  (via drill 0.2)
  Top 0.125: IC1.D16 41.3,25 v41.3,29.3 | IC7.R8 v24,31.6
  Bottom 0.125: v24,31.6 29.5,31.6 30.1,32.2 35.8,32.2 37.2,30.8 39.7,30.8 41.2,29.3 v41.3,29.3
BA0
  Top 0.125: IC7.L2 29.2,28.2 39.2,28.2 40.5,26.9 40.5,25 IC1.C16
BA1
  Top 0.125: IC7.L3 28.4,27.4 38.8,27.4 39.3,26.9 IC1.B17
BA2
  Top 0.125: IC7.L1 39,27.8 39.7,27.1 39.7,24.4 39.9,24.2 41.3,24.2 IC1.E15
CAS
  Top 0.125: IC7.L7 25.6,27.8 26.3,27.1 26.3,18.3 26.5,18.1 36,18.1 36.5,18.6 39.5,18.6 39.7,18.8 39.7,19.4 IC1.C10
CTS0
  Top 0.125: IC1.N4 47.7,14.6 47.7,8.3 46.6,7.2 46.6,4.32
  Top 0.61: 46.6,4.32 JP1.7
DQ0  (via drill 0.2)
  Top 0.125: IC7.G8 v24.4,24.2 | IC1.D14 v41.3,22.6
  Bottom 0.125: v24.4,24.2 27.6,24.2 28,23.8 40.1,23.8 v41.3,22.6
DQ1  (via drill 0.2)
  Top 0.125: IC1.D15 v41.3,23.4 | v29.2,24.2 IC7.G2
  Bottom 0.125: v41.3,23.4 40.5,24.2 33.8,24.2 33.7,24.3 33.7,24.9 33.6,25 33.4,25 33.3,24.9 33.3,24.3 33.2,24.2 33,24.2 32.9,24.3 32.9,24.9 32.8,25 32.6,25 32.5,24.9 32.5,24.3 32.4,24.2 32.2,24.2 32.1,24.3 32.1,24.9 32,25 31.8,25 31.7,24.9 31.7,24.3 31.6,24.2 31.4,24.2 31.3,24.3 31.3,24.9 31.2,25 31,25 30.9,24.9 30.9,24.3 30.8,24.2 v29.2,24.2
DQ2  (via drill 0.2)
  Top 0.125: IC7.H7 v25.2,25 | IC1.A16 v37.1,24.6
  Bottom 0.125: v37.1,24.6 37.1,25.7 37,25.8 36.7,25.8 36.6,25.7 36.6,25.2 36.5,25.1 36.3,25.1 36.2,25.2 36.2,25.7 36.1,25.8 35.9,25.8 35.8,25.7 35.8,25.2 35.7,25.1 35.5,25.1 35.4,25.2 35.4,25.7 35.3,25.8 28.8,25.8 28.3,26.3 25.4,26.3 25.2,26.1 v25.2,25
DQ3
  Top 0.125: IC7.H3 28.4,25.8 30.4,25.8 30.6,26 30.6,26.7 30.9,27 36.8,27 36.9,26.9 36.9,25.9 37,25.8 37.3,25.8 37.4,25.9 37.4,26.9 37.5,27 37.8,27 37.9,26.9 37.9,25.9 38,25.8 38.3,25.8 38.4,25.9 38.4,26.9 38.5,27 38.8,27 38.9,26.9 38.9,25 IC1.B16
DQ4
  Top 0.125: IC1.A17 36.4,25.4 36.3,25.5 36.3,26.4 36.2,26.5 35.9,26.5 35.8,26.4 35.8,25.5 35.7,25.4 35.5,25.4 35.4,25.5 35.4,26.4 35.3,26.5 35,26.5 34.9,26.4 34.9,25.5 34.8,25.4 33.7,25.4 33.6,25.5 33.6,26.4 33.5,26.5 33.2,26.5 33.1,26.4 33.1,25.5 33,25.4 32.7,25.4 32.6,25.5 32.6,26.4 32.5,26.5 32.2,26.5 32.1,26.4 32.1,25.5 32,25.4 31.7,25.4 31.6,25.5 31.6,26.4 31.5,26.5 31.2,26.5 31.1,26.4 31.1,25.5 31,25.4 IC7.H1
DQ5  (via drill 0.2)
  Top 0.125: IC7.H9 v23.6,25 | IC1.B15 38.9,24.2 36.8,24.2 v36.4,24.6
  Bottom 0.125: v23.6,25 24,24.6 27.3,24.6 28.1,25.4 34,25.4 34.1,25.3 34.1,24.7 34.2,24.6 34.5,24.6 34.6,24.7 34.6,25.3 34.7,25.4 35,25.4 35.1,25.3 35.1,24.7 35.2,24.6 v36.4,24.6
DQ6  (via drill 0.2)
  Top 0.125: IC7.F1 31.1,23.8 v31.9,23 | IC1.C14 v39.7,23.4
  Bottom 0.125: v39.7,23.4 39.7,22.3 39.6,22.2 39.3,22.2 39.2,22.3 39.2,22.8 39.1,22.9 38.8,22.9 38.7,22.8 38.7,22.3 38.6,22.2 37.6,22.2 37.5,22.3 37.5,22.9 37.4,23 37.1,23 37,22.9 37,22.3 36.9,22.2 36.6,22.2 36.5,22.3 36.5,22.9 36.4,23 36.1,23 36,22.9 36,22.3 35.9,22.2 35.6,22.2 35.5,22.3 35.5,22.9 35.4,23 35.1,23 35,22.9 35,22.3 34.9,22.2 34.6,22.2 34.5,22.3 34.5,22.9 34.4,23 34.1,23 34,22.9 34,22.3 33.9,22.2 33.6,22.2 33.5,22.3 33.5,22.9 33.4,23 v31.9,23
DQ7  (via drill 0.2)
  Top 0.125: IC7.F9 v23.6,23.4 | IC1.B14 v38.9,23.4
  Bottom 0.125: v23.6,23.4 24,23.8 25.8,23.8 25.9,23.7 25.9,23.4 26,23.3 26.3,23.3 26.4,23.4 26.4,23.7 26.5,23.8 27.2,23.8 27.6,23.4 37.8,23.4 37.9,23.3 37.9,22.6 38,22.5 38.2,22.5 38.3,22.6 38.3,23.3 38.4,23.4 v38.9,23.4
DQ8  (via drill 0.2)
  Top 0.125: IC1.A15 36,23.8 35.9,23.9 35.9,24.8 35.8,24.9 33.3,24.9 33.2,24.8 33.2,23.9 33.1,23.8 32.9,23.8 32.8,23.9 32.8,24.8 32.7,24.9 32.5,24.9 32.4,24.8 32.4,22.8 32.2,22.6 v30.8,22.6 | v24.4,21.8 IC7.C8
  Bottom 0.125: v30.8,22.6 30,21.8 v24.4,21.8
DQ9  (via drill 0.2)
  Top 0.125: IC7.C2 29.2,21 30.4,21 v30.8,21.4 | v40.5,22.6 40.5,23.4 IC1.C15
  Bottom 0.125: v30.8,21.4 37.4,21.4 37.6,21.2 37.6,20 37.7,19.9 37.9,19.9 38,20 38,21.3 38.1,21.4 38.3,21.4 38.4,21.3 38.4,20 38.5,19.9 38.7,19.9 38.8,20 38.8,21.2 39,21.4 40.1,21.4 40.5,21.8 v40.5,22.6
DQ10  (via drill 0.2)
  Top 0.125: IC1.D12 v40.5,21 | v25.2,21 25.2,21.8 IC7.D7
  Bottom 0.125: v40.5,21 39.3,21 39.1,20.8 39.1,19.8 38.9,19.6 37.5,19.6 37.3,19.8 37.3,20.8 37.1,21 29.2,21 28.8,21.4 25.6,21.4 v25.2,21
DQ11
  Top 0.125: IC7.D3 28.4,21.8 31.2,21.8 31.3,21.7 31.3,21.1 31.4,21 31.6,21 31.7,21.1 31.7,21.7 31.8,21.8 32,21.8 32.1,21.7 32.1,21.1 32.2,21 32.4,21 32.5,21.1 32.5,21.7 32.6,21.8 32.8,21.8 32.9,21.7 32.9,21.1 33,21 33.2,21 33.3,21.1 33.3,21.7 33.4,21.8 33.6,21.8 33.7,21.7 33.7,21.1 33.8,21 34,21 34.1,21.1 34.1,22.5 34.2,22.6 34.4,22.6 34.5,22.5 34.5,22 34.6,21.9 34.8,21.9 34.9,22 34.9,22.5 35,22.6 39.7,22.6 IC1.C13
DQ12
  Top 0.125: IC7.D1 32.6,22.2 32.8,22.4 32.8,23.3 32.9,23.4 33.1,23.4 33.2,23.3 33.2,22.3 33.3,22.2 33.5,22.2 33.6,22.3 33.6,24.3 33.7,24.4 33.9,24.4 34,24.3 34,23.1 34.1,23 34.3,23 34.4,23.1 34.4,24.3 34.5,24.4 34.7,24.4 34.8,24.3 34.8,23.1 34.9,23 35.1,23 35.2,23.1 35.2,24.3 35.3,24.4 35.5,24.4 35.6,24.3 35.6,23.1 35.7,23 IC1.A14
DQ13  (via drill 0.2)
  Top 0.125: v25.2,22.6 23.6,22.6 IC7.D9 | IC1.B13 v39.7,21.8
  Bottom 0.125: v39.7,21.8 32.5,21.8 32.4,21.9 32.4,22.4 32.3,22.5 32,22.5 31.9,22.4 31.9,21.9 31.8,21.8 31.5,21.8 31.4,21.9 31.4,22.8 31.2,23 25.6,23 v25.2,22.6
DQ14
  Top 0.125: IC7.B1 30.4,20.6 30.5,20.5 30.5,19.6 30.6,19.5 30.8,19.5 30.9,19.6 30.9,20.6 31,20.7 31.2,20.7 31.3,20.6 31.3,19.6 31.4,19.5 31.6,19.5 31.7,19.6 31.7,20.6 31.8,20.7 32,20.7 32.1,20.6 32.1,19.6 32.2,19.5 32.4,19.5 32.5,19.6 32.5,20.6 32.6,20.7 32.8,20.7 32.9,20.6 32.9,19.6 33,19.5 33.2,19.5 33.3,19.6 33.3,20.6 33.4,20.7 33.7,20.7 33.8,20.6 33.8,20.4 33.9,20.3 34.4,20.3 34.5,20.4 34.5,21.1 35.6,22.2 IC1.A13
DQ15  (via drill 0.2)
  Top 0.125: v23.6,20.2 IC7.B9 | IC1.C12 39.7,21 35.9,21 35.5,20.6 35.5,18.8 35.1,18.4 26.9,18.4 v26.8,18.5
  Bottom 0.125: v23.6,20.2 23.6,19.6 24.7,18.5 v26.8,18.5
DQM0  (via drill 0.2)
  Top 0.125: IC1.A10 v36.3,19.8 | IC7.F3 27.4,23.2 v27.4,20.2
  Bottom 0.125: v36.3,19.8 35.8,19.3 35.8,18.5 35.7,18.4 35.5,18.4 35.4,18.5 35.4,19.3 35.3,19.4 35.1,19.4 35,19.3 35,18.5 34.9,18.4 28.2,18.4 28,18.6 28,19.6 v27.4,20.2
DQM1  (via drill 0.2)
  Top 0.125: IC1.B10 38.9,20.2 v36.8,20.2 | IC7.B3 v28.4,20.2
  Bottom 0.125: v36.8,20.2 35.6,20.2 35.5,20.1 35.5,19.8 35.4,19.7 35.2,19.7 35.1,19.8 35.1,20.1 35,20.2 34.7,20.2 34.6,20.1 34.6,18.8 34.5,18.7 34.3,18.7 34.2,18.8 34.2,19.05 34.1,19.15 33.9,19.15 33.8,19.05 33.8,18.8 33.7,18.7 30.5,18.7 30.4,18.8 30.4,19.6 30.3,19.7 30.1,19.7 30,19.6 30,18.8 29.9,18.7 29.7,18.7 29.6,18.8 29.6,19.6 29.5,19.7 29.3,19.7 29.2,19.6 29.2,18.8 29.1,18.7 28.9,18.7 28.8,18.8 28.8,19.8 v28.4,20.2
DQS0  (via drill 0.2)
  Top 0.125: IC7.F7 v24.4,23.4 | IC1.A11 v36.3,20.6
  Bottom 0.125: v24.4,23.4 24,23 24,20.7 24.1,20.6 25.5,20.6 25.6,20.5 25.6,20 25.7,19.9 25.9,19.9 26,20 26,20.5 26.1,20.6 v36.3,20.6
DQS1  (via drill 0.2)
  Top 0.125: IC7.B7 25.2,20.2 v25.2,19 | IC1.A9 v36.3,19
  Bottom 0.125: v36.3,19 36.3,18.3 36.1,18.1 27.8,18.1 27.6,18.3 27.6,19.5 27.5,19.6 27.3,19.6 27.2,19.5 27.2,19.1 27.1,19 26.9,19 26.8,19.1 26.8,19.5 26.7,19.6 26.5,19.6 26.4,19.5 26.4,19.1 26.3,19 26.1,19 26,19.1 26,19.5 25.9,19.6 25.7,19.6 25.6,19.5 25.6,19.1 25.5,19 v25.2,19
DRXD  (via drill 0.2)
  Top 0.125: IC1.U3 52.1,13.4 52.9,13.4 53.6,12.7 v53.6,9.7
  Bottom 0.2: v53.6,9.7 53.6,8.4 54.2,7.8 54.2,4.34
  Bottom 0.61: 54.2,4.34 JP1.13
DTXD
  Top 0.125: IC1.T1 50.5,8.7 51.5,7.7 54.8,7.7 55.5,7 | JP1.14
  Top 0.61: 55.5,7 JP1.14
ETH_CLK  (via drill 0.2)
  Top 0.125: IC1.D1 40.9,9.5 40.1,8.7 v40.1,7.6
  Bottom 0.254: v40.1,7.6 38,7.6 37.2,6.8 37.2,4.6 36.9,4.3 34.55,4.3 R52.1
ETH_CRS_DV  (via drill 0.2)
  Top 0.125: v30.5,10 30,10 29.9,10.1 29.85,10.1 IC3.15 | IC1.E4 v41.3,14.6
  Bottom 0.125: v41.3,14.6 41.7,14.2 41.7,9 40.8,8.1 37.6,8.1 36,6.5 31,6.5 30.5,7 v30.5,10
ETH_MDC  (via drill 0.2)
  Top 0.125: IC1.B3 38.9,13.8 v38.9,10.6 | IC3.17 v29.8,11.3
  Bottom 0.125: v29.8,11.3 38.2,11.3 v38.9,10.6
ETH_MDIO  (via drill 0.2)
  Top 0.125: IC1.E3 v41.3,13.8 | IC3.16 29.85,10.6
  Top 0.2: 29.85,10.6 30.9,10.6 v31,10.7 31,13.4 31.3,13.7 R28.1
  Bottom 0.125: v41.3,13.8 41.3,9.2 40.6,8.5 37.4,8.5 35.9,7 31.5,7 31,7.5 v31,10.7
ETH_RXD0  (via drill 0.2)
  Top 0.125: IC1.D3 v40.5,13.8
  Top 0.2: IC3.11 29.85,8 v34.9,8
  Bottom 0.125: v40.5,13.8 40.5,9.6 40.2,9.3 37,9.3 35.7,8 v34.9,8
ETH_RXD1  (via drill 0.2)
  Top 0.125: IC1.D4 v40.5,14.6
  Top 0.2: IC3.10 29.85,7.5 v35.3,7.5
  Bottom 0.125: v40.5,14.6 40.9,14.2 40.9,9.4 40.4,8.9 37.2,8.9 35.8,7.5 v35.3,7.5
ETH_RXER  (via drill 0.2)
  Top 0.125: IC1.D2 40.5,13 40.5,10.4 v39.9,9.8
  Top 0.2: IC3.13 30.55,9.05 v31.5,10 32.25,10 R6.2
  Bottom 0.125: v31.5,10 31.7,9.8 v39.9,9.8
ETH_TXD0  (via drill 0.2)
  Top 0.125: IC1.C1 v40.1,11.3
  Top 0.2: IC3.22 v26.55,12.3
  Bottom 0.125: v26.55,12.3 26.75,12.5 38.9,12.5 v40.1,11.3
ETH_TXD1  (via drill 0.2)
  Top 0.125: IC1.B2 v39.7,13.8
  Top 0.2: IC3.23 v26.05,12.6
  Bottom 0.125: v26.05,12.6 26.35,12.9 38.8,12.9 v39.7,13.8
ETH_TXEN  (via drill 0.2)
  Top 0.125: IC1.C2 39.7,13 v39.7,10.6
  Top 0.2: IC3.21 v27.05,12
  Bottom 0.125: v27.05,12 38.3,12 v39.7,10.6
GND  (via drill 0.2, 0.3 pad 0.6)
  Top 0.125: IC1.J9 v44.5,19.4 | IC1.U13 v51.9,22.2
  Top 0.15: IC1.B7 v39.7,17.8
  Top 0.2: IC7.D8 v23.6,21.8 | IC7.B8 v24.4,20.2 IC7.A7 | IC7.E7 v25.2,23.4 | IC7.F8 v23.6,24.2 | IC7.H8 v24.4,25.8 IC7.J7 | IC7.N1 v30.1,29.4 | IC7.J3 v27.6,25.8 | IC7.F2 v28.4,24.2 | IC7.E3 v28.4,22.6 IC7.D2 | IC7.B2 v29.2,20.2 | IC7.H2 v29.2,25 | IC1.J8 v44.5,17.8 | IC1.H9 v43.7,18.6 | IC1.H8 v43.7,17.8 | IC1.H10 v43.7,19.4 | IC1.J10 v45.3,20.2 | IC1.K10 v46.1,20.2 | IC1.D6 v41.3,17 | IC1.B6 v39.7,17 | IC1.M4 v46.9,15.4 | IC1.P6 v48.5,16.2 | IC1.T16 v50.1,25 | IC7.A3 v28.4,19.4
  Top 0.305: IC7.P9 v23.2,30.8 | C6.2 v18.5,28.6 | C7.2 v18.5,25.8 | C8.2 v18.5,24.2 | C9.2 v18.5,22.6 | C10.2 v18.5,21 | C11.2 v18.5,19.4 | IC7.K9 v23.6,26.6
  Top 0.61: C2.2 R2.1 | 34.6,14.5 v34.6,13.9 34.6,13.4
  Bottom 0.2: C3.2 32.95,19.7 | C4.2 33.15,26.4 | C5.2 33,31.4
  other vias: 34,19.8 34.25,26.4 34,31 35.2,8.8 37.1,14.75 28.1,16.4 24.4,16.4 29.4,1.7 25.2,1.7 23.7,1.7 18.3,7 17.9,10.3 18.1,17.3 22.4,33 21.1,36.1 28.7,39.7 28.7,41.9 28.7,36.1 29.6,36.1 32.2,33 33,33 31.4,33 45.1,34.9 40.5,39 40.1,42 42.3,34.1 45.9,34.9 52.6,33.3 55,33.3 56.4,34.8 52.4,30.9 54,30.9 55.6,30.9 51.8,37.7 51.4,41.9 51.8,37 52.5,36.3 49.5,44 46.9,44 58.5,22 52.8,18.9 52.7,23.6 55.7,25.1 54.1,25.1 54.1,14 58.3,19.7 58.7,38.9 58.6,41.2 61.2,42 63.5,42.7 58.6,42 63.5,32.7 63.1,29 59.9,42 24.8,11.3 58.7,37.4 45,27.5 46.5,27.5 47.55,20.9 42.5,16.25 43.45,17.05 30.5,36.1 22.4,36.1 35.2,10.5 29.4,1.1 35.2,1.2 37.9,39 38.1,33.9 34.6,34.2 43.4,30.3 43.4,29.5 47.7,26.2
  pour Top (isolate 0.2): -5,53 -5,-5 70,-5 70,53
  pour Route2 (isolate 0.2): -10,58 -10,-10 75,-10 75,58
  pour Bottom (isolate 0.254): -20,68 -20,-20 85,-20 85,68
HFSDMA  (via drill 0.2)
  Top 0.125: IC1.T15 v50.9,24.2
  Bottom 0.2: v50.9,24.2 50.9,25.75 R12.1
HFSDMB
  Top 0.125: IC1.P16 48.5,25 48.5,26.3 47.6,27.2 R16.1
HFSDMC
  Top 0.125: IC1.M17 47.3,25.7 46,27 R20.1
HFSDPA  (via drill 0.2)
  Top 0.125: IC1.T14 v50.1,23.4
  Bottom 0.2: v50.1,23.4 48.85,23.4 R11.1
HFSDPB
  Top 0.125: IC1.R16 49.3,25 49.3,27.65 R15.1
HFSDPC
  Top 0.125: IC1.L17 46.5,26 45.6,26.9 45.6,28 44.8,28.8 44.8,29.05 R19.1
HHSDMA  (via drill 0.2)
  Top 0.125: IC1.U15 v51.9,23.8
  Bottom 0.2: v51.9,23.8 51.9,25.75 | 51.9,25.75 R12.2 | 51.9,25.75 51.9,26.8 51.7,27 48.9,27 44.6,31.3 42.8,31.3 38.7,35.4 13.03,35.4 11.43,37
  Bottom 0.6: 11.43,37 X1.A2
HHSDMB  (via drill 0.2)
  Top 0.125: IC1.P17 48.9,26.4 48.4,26.9 48.4,28.65 R16.2
  Top 0.2: R16.2 47.6,29.5 48.1,30 48.1,31.5 46.9,32.7 45.3,32.7 v45.2,32.6 | X1.B2 | 8.7,38.5 9.2,39 12.7,39 v13.9,37.8
  Top 0.6: X1.B2 8.7,38.5
  Bottom 0.2: v45.2,32.6 45.1,32.7 45,32.7 39.8,37.9 14,37.9 v13.9,37.8
HHSDPA  (via drill 0.2)
  Top 0.125: IC1.U14 v50.9,23.4
  Bottom 0.2: v50.9,23.4 49.6,24.7 49.15,24.7 R11.2 48.8,26.5 44.4,30.9 42.6,30.9 38.5,35 12.8,35 12.3,35 11.5,35.8
  Bottom 0.6: 11.5,35.8 X1.A3
HHSDPB  (via drill 0.2)
  Top 0.125: IC1.R17 49.7,26.4 50,26.7 50,28.65 R15.2
  Top 0.2: R15.2 49.2,29.5 48.7,30 48.7,31.6 47.2,33.1 45.8,33.1 v45.7,33.2 | X1.B3 | 8.6,36.4 9,36.8 v13.2,36.8
  Top 0.6: X1.B3 8.6,36.4
  Bottom 0.2: v45.7,33.2 45.6,33.1 45.2,33.1 40,38.3 13.6,38.3 13.2,37.9 v13.2,36.8
N$1  (via drill 0.2)
  Top 0.2: IC7.J2 v29.2,26.6
  Top 0.305: v18.5,30.2 C1.2
  Top 0.61: C1.2 R1.1 R2.2 C2.1
  Bottom 0.2: v29.2,26.6 28.4,27.4 20.2,27.4 19.5,28.1 19.5,29.2 v18.5,30.2
N$2  (via drill 0.2)
  Top 0.254: IC3.5 27.55,5.45 v27.5,5.4
  Bottom 0.254: v27.5,5.4 30.7,5.4 31,5.1 R51.2
N$4
  Top 0.406: PWR.A 54.95,42.9 R13.2
N$17  (via drill 0.2)
  Top 0.2: R19.2 44.4,31.3 44.2,31.5 43.7,31.5 42.4,32.8 34.3,32.8 v34.2,32.9
  Bottom 0.2: v34.2,32.9 33.4,33.7 17,33.7 16,32.7 16,23.9 15.4,23.3 12.4,23.3 11.9,23.8
  Bottom 0.6: X5.D+ 11.33,24.37 11.9,23.8
N$18  (via drill 0.2)
  Top 0.2: R20.2 46,31.8 45.7,32.1 43.7,32.1 42.6,33.2 34.7,33.2 v34.6,33.3
  Bottom 0.2: v34.6,33.3 34.5,33.3 33.7,34.1 16.7,34.1 15.6,33 15.6,26 15.1,25.5 10.4,25.5 10,25.1
  Bottom 0.6: X5.D- 9.33,24.43 10,25.1
N$19  (via drill 0.2)
  Top 0.125: IC1.U6 51.5,16.8 v52.3,16.8
  Top 0.2: v59.2,21.6 R27.1
  Bottom 0.2: v52.3,16.8 58.3,16.8 58.9,17.4 58.9,21.3 v59.2,21.6
N$20  (via drill 0.2)
  Top 0.125: IC1.T5 50.9,15.4 52,15.4 52.1,15.3 v52.8,15.3
  Top 0.2: v59.3,15.3 59.3,16.3 59.5,16.5 R26.1
  Bottom 0.2: v52.8,15.3 v59.3,15.3
N$21  (via drill 0.2)
  Top 0.125: IC1.U5 v52.3,15.8
  Top 0.2: v58.8,15.8 58.8,17.9 59.1,18.2 R25.1
  Bottom 0.2: v52.3,15.8 v58.8,15.8
N$22  (via drill 0.2)
  Top 0.125: IC1.R5 v50.1,15.4 | 55.45,13.3 R24.1
  Top 0.2: v54.5,13.3 55.45,13.3
  Bottom 0.2: v50.1,15.4 50.9,15.4 53,13.3 v54.5,13.3
N$23  (via drill 0.2)
  Top 0.125: IC1.P5 49.3,16.2 51.9,16.2 52,16.3 v52.8,16.3
  Top 0.2: v59.4,19.9 R23.1
  Bottom 0.2: v52.8,16.3 58.8,16.3 59.4,16.9 v59.4,19.9
N$24  (via drill 0.2)
  Top 0.125: IC1.U4 52.1,15 v52.3,14.8
  Top 0.2: v58.8,14.8 R22.1
  Bottom 0.2: v52.3,14.8 v58.8,14.8
N$25
  Top 0.2: IC1.U17 52.6,25.4 53.9,26.7 53.9,27.4 54,27.5 R40.2
  Top 0.406: C49.1 R40.2
N$26
  Top 0.125: IC1.U12 53.2,21.4 53.5,21.1 53.5,19.9 Q1.1
  Top 0.406: C46.1 54.95,18.45 Q1.1
N$27
  Top 0.125: IC1.T12 50.9,21.8 53.2,21.8 Q1.2
  Top 0.406: C47.1 54.95,23.55 Q1.2
N$28  (via drill 0.2)
  Top 0.2: R38.1 v57.4,17.4 | v49.3,18.6 IC1.P9
  Bottom 0.2: v57.4,17.4 50.5,17.4 v49.3,18.6
N$29
  Top 0.254: IC3.32 23.25,7.05 22.9,6.7 21.45,6.7 R30.1
N$30
  Top 0.2: IC3.6 28.05,4.45 28,4.4 C16.1 C17.1
N$31
  Top 0.2: IC1.G1 43.3,11.8 43.7,11.4 43.7,10.45 R50.1
N$32
  Top 0.406: IC4.3 36.75,37.05 L6.1
N$33
  Top 0.406: IC5.3 25.35,37.05 L7.1
N$35
  Top 0.406: IC4.5 43.5,38.95 R41.1 C51.2 R42.2
N$36
  Top 0.406: IC5.5 32,38.95 R44.1 C54.2 R45.2
N$37
  Top 0.406: R43.1 38.45,39.65 IC4.1
N$38
  Top 0.406: R46.1 26.95,39.65 IC5.1
N$39
  Top 0.406: IC6.3 48.15,37.05 L8.1
N$40
  Top 0.406: IC6.5 54.8,38.95 R47.1 C57.2 R48.2
N$41
  Top 0.406: C59.1 R49.1 49.4,39.4 49.8,39 50.4,39 IC6.1
N$42
  Top 0.2: 37.4,12.1 37.4,11.5 38,11.5
N$43
  Top 0.2: 51.8,11.5 52.4,11.5 52.4,12.1
N$44
  Top 0.2: 52.4,25.9 52.4,26.5 51.8,26.5
N$45
  Top 0.2: R50.2 42.05,8.9 LED1.A
N$46  (via drill 0.2)
  Top 0.305: Q2.3 32.85,1.25 v32.8,1.2
  Bottom 0.305: R52.2 34.5,1.5 34.2,1.2 v32.8,1.2 31.3,1.2 31,1.5 R51.1
N$58
  Bottom 0.406: R10.1 51.75,29.95 51.1,30.6 49.89,30.6 X3.SW1
N$101  (via drill 0.2)
  Top 0.2: IC3.2 26.05,3.65 v26.1,3.6 | v22.1,2.8 R33.1
  Bottom 0.2: v26.1,3.6 22.9,3.6 v22.1,2.8
N$106  (via drill 0.2)
  Top 0.2: IC3.3 26.55,4.35 v26.6,4.3 | v22.1,4.3 21.25,4.3 R31.1
  Bottom 0.2: v26.6,4.3 v22.1,4.3
N$107  (via drill 0.2, 0.3 pad 0.6)
  Top 0.254: IC3.30 21.75,8.05 v21.7,8
  Top 0.406: R35.1 v18.1,8.99 X4.6
  Bottom 0.254: v21.7,8 19.1,8 18.9,8.2 18.89,8.2 v18.1,8.99
N$108  (via drill 0.2, 0.3 pad 0.6)
  Top 0.254: IC3.31 22.45,7.55 v22.3,7.4
  Top 0.406: X4.3 v18.1,12.8 19.15,12.8 R34.1
  Bottom 0.254: v22.3,7.4 22.3,12.1 21.6,12.8 v18.1,12.8
N$110  (via drill 0.2, 0.3 pad 0.6)
  Top 0.254: IC3.29 23.55,8.55 v23.5,8.6
  Top 0.406: X4.1 v18.1,15.35 19.09,15.35 R29.1
  Bottom 0.254: v23.5,8.6 23.5,14.6 22.7,15.4 18.16,15.4 v18.1,15.35
N$111
  Top 0.406: X4.K2 1.74,2.06 2.7,1.1 18.7,1.1 19.4,1.8 19.4,2.75 R33.2
N$112
  Top 0.406: R31.2 11.8,4.4 3.3,12.9 3.3,16 1.77,17.52 X4.A1
N$114  (via drill 0.2, 0.3 pad 0.6)
  Top 0.254: IC3.28 23.95,9.05 23.9,9.1 v22.9,9.1
  Top 0.406: X4.2 v18.1,14.07 19.43,14.07 R32.1
  Bottom 0.254: v22.9,9.1 22.9,13.4 22.2,14.1 18.12,14.1 v18.1,14.07
NRST  (via drill 0.2)
  Top 0.2: C48.1 53.35,16.55 52.4,17.5 v52.4,18.2 | v49.3,19.4 IC1.P10 | IC3.19 28.05,13.7 C19.1 v27.3,13.75 | RESET.1 62.2,26.5 v62.2,25.4
  Top 0.406: C48.1 R37.1 | R36.1 C19.1 | RESET.3 RESET.1
  Route15 0.2: v27.3,13.75 31.35,13.75 32.6,12.5 45.6,12.5 51.3,18.2 v52.4,18.2 59.7,18.2 60.9,19.4 60.9,24.2 62.1,25.4 v62.2,25.4
  Bottom 0.2: v52.4,18.2 50.5,18.2 v49.3,19.4
PWR_CORE  (via drill 0.2, 0.3 pad 0.6)
  Top 0.2: IC1.K8 v46.1,17.8 | IC1.K9 v46.1,19.4 | IC1.H14 v44.5,23.4 | IC1.T17 50.5,27.45 C36.1
  Top 0.406: L8.2 C56.1 v50.65,33.3 | v57.6,39 R47.2 C57.1 | C37.1 52.4,27.6 v51.6,27.6 50.8,27.6 C36.1
  Route15 0.406: v50.65,33.3 51.35,34 56.6,34 57.6,35 v57.6,39 | v58.2,18.7 56.4,18.7 54.8,20.3 46.7,20.3
  Route15 0.61: v44.5,23.4 44.5,24.5 47.6,27.6 v51.6,27.6 51.6,28.9 50.65,29.85 v50.65,33.3
  Bottom 0.2: C26.1 46.1,18.6 | C27.1 46.1,17 | v44.5,23.4 44.5,22.9 44.7,22.7 45.5,22.7 45.7,22.5 45.7,21.85 C25.1
  Bottom 0.406: 46.1,18.6 v46.1,17.8 46.1,17 | L4.2 v58.2,18.7
  pour Route15 (isolate 0.2): 44.2,23.8 44.2,19.9 44.9,19.9 44.9,17.3 46.8,17.3 46.8,21.2 44.8,21.2 44.8,23.8
RAS  (via drill 0.2)
  Top 0.125: IC7.K7 25.6,27 26,26.6 26,18.1 26.3,17.8 36.4,17.8 v36.8,18.2 | IC1.B11 v39.7,20.2
  Bottom 0.125: v36.8,18.2 37.6,19 39.3,19 39.7,19.4 v39.7,20.2
RMIISEL
  Top 0.2: IC3.9 31.75,7.05 32.3,6.5 R21.2
RTS0
  Top 0.125: IC1.L4 46.1,14.6 46.1,9.3 44.1,7.3 44.1,4.28
  Top 0.61: 44.1,4.28 JP1.5
RXD0
  Top 0.125: IC1.P1 48.9,8.1 47.9,7.1 | JP1.8
  Top 0.61: 47.9,7.1 JP1.8
RXD1  (via drill 0.2)
  Top 0.125: IC1.R4 v49.3,14.6
  Bottom 0.125: 52.9,5.64 JP1.12
  Bottom 0.2: v49.3,14.6 49.3,10.7 52.9,7.1
  Bottom 0.61: 52.9,7.1 52.9,5.64
RXD2  (via drill 0.2)
  Top 0.125: IC1.P4 48.5,14.6 48.5,10.1 v48.4,10
  Bottom 0.2: v48.4,10 51.7,6.7 51.7,4.3
  Bottom 0.61: 51.7,4.3 JP1.11
SD0-CLK  (via drill 0.2)
  Top 0.2: R24.2 v58.3,13.1 | v58.8,22.9 58.8,23.7 v59.7,24.6
  Bottom 0.2: X3.5 48.5,36 48.7,35.8 59,35.8 59.7,35.1 v59.7,24.6 | v58.3,13.1 59.5,13.1 60,13.6 60,21.7 v58.8,22.9
SD0-CMD  (via drill 0.2)
  Top 0.2: v62.7,19.9 R23.2
  Bottom 0.2: X3.3 59.2,38.2 60.2,37.2 60.2,24 62.7,21.5 v62.7,19.9
  Bottom 0.406: R5.1 42.4,41.2 43.1,40.5 45.5,40.5 45.9,40.1 45.9,39.1 46.8,38.2 X3.3
SD0-D0  (via drill 0.2)
  Top 0.2: v63.2,14.8 R22.2
  Top 0.406: R22.2 R7.1
  Bottom 0.2: X3.7 48.7,33.8 48.9,34 58.3,34 59.2,33.1 59.2,24.2 62.1,21.3 62.1,19.7 63.2,18.6 v63.2,14.8
SD0-D1  (via drill 0.2)
  Top 0.2: v62.7,18.2 R25.2 | R8.1 v62.7,11.5
  Bottom 0.2: X3.8 48.7,32.7 48.9,32.5 58.3,32.5 58.7,32.1 58.7,24 61.4,21.3 61.4,19.5 v62.7,18.2 v62.7,11.5
SD0-D2  (via drill 0.2)
  Top 0.2: R26.2 v63.7,16.5
  Bottom 0.2: X3.1 60.1,40.4 61.2,39.3 61.2,24.6 63.7,22.1 v63.7,16.5
  Bottom 0.406: R3.1 46.85,42.55 47.8,41.6 47.8,40.4 X3.1
SD0-D3  (via drill 0.2)
  Top 0.2: v61.9,23.1 61.9,21.65 R27.2
  Bottom 0.2: X3.2 48.5,39.3 48.8,39.6 59.1,39.6 59.5,39.6 60.7,38.4 60.7,38 60.7,24.3 v61.9,23.1
  Bottom 0.406: R4.1 44.1,41.8 44.6,41.3 46.4,41.3 46.8,40.9 46.8,39.7 47.2,39.3 X3.2
SD0-DET#
  Bottom 0.406: X3.SW2 R9.1
SDA10  (via drill 0.2)
  Top 0.125: IC7.M2 v36.4,28.6 | v40.5,18.6 IC1.C8
  Bottom 0.125: v36.4,28.6 37.4,27.6 37.4,26.4 38.8,25 40.7,25 41.7,24 41.7,22.2 40.9,21.4 40.9,19 v40.5,18.6
SDCK  (via drill 0.2)
  Top 0.125: IC7.J8 v23.6,25.8 | IC1.D11 v41.3,20.2
  Bottom 0.125: v23.6,25.8 22.8,26.6 22,26.6 21.8,26.4 21.8,17.8 22.2,17.4 37.3,17.4 38.1,18.2 40.9,18.2 41.3,18.6 v41.3,20.2
SDCKE
  Top 0.125: IC1.B12 38.9,21.8 35.7,21.8 34.9,21 34.9,19.4 34.5,19 27.5,19 26.9,19.6 26.9,26.4 27.1,26.6 28.4,26.6 IC7.K2
SDCS
  Top 0.125: IC7.L8 24.4,27.4 24.4,26.8 24.6,26.6 25.4,26.6 25.7,26.3 25.7,17.9 26.1,17.5 36.8,17.5 37.1,17.8 38.9,17.8 IC1.B8
SDWE
  Top 0.125: IC1.A12 35.8,21.4 35.2,20.8 35.2,19.1 34.8,18.7 27.3,18.7 26.6,19.4 26.6,26.7 26.9,27 IC7.K3
SPI0_MISO
  Top 0.125: IC1.U1 51.3,9.3 52.1,8.5 59.9,8.5 60.6,7.8 60.6,7 | JP1.18
  Top 0.61: 60.6,7 JP1.18
SPI0_MOSI
  Top 0.125: IC1.T2 50.9,13 50.9,9 51.8,8.1 58.5,8.1 59.3,7.3 59.3,4.32
  Top 0.61: 59.3,4.32 JP1.17
SPI0_NPCS0
  Top 0.125: IC1.U2 51.7,13 52.6,13 53,12.6 53,9.4 53.5,8.9 60.8,8.9 61.9,7.8 61.9,4.26
  Top 0.61: 61.9,4.26 JP1.19
SPI0_SPCK  (via drill 0.2)
  Top 0.125: IC1.T4 v50.9,14.6
  Bottom 0.125: 63.1,5.6 JP1.20
  Bottom 0.2: v50.9,14.6 50.9,11.5 51.5,10.9 54.7,10.9 57.8,7.8 62.5,7.8 63.1,7.2
  Bottom 0.406: 63.1,7.2 63.1,5.6
TXD0
  Top 0.125: IC1.L3 46.9,13.8 46.9,8.6 45.4,7.1 | 45.4,5.62 JP1.6
  Top 0.61: 45.4,7.1 45.4,5.62
TXD1
  Top 0.125: IC1.R1 49.7,7.7 50.3,7.1 | 50.3,5.7 JP1.10
  Top 0.61: 50.3,7.1 50.3,5.7
TXD2
  Top 0.125: IC1.R3 49.3,13.8 49.3,4.16
  Top 0.61: 49.3,4.16 JP1.9
VBAT
  Top 0.406: D1.2 38.05,2.65 38.2,2.8 40.04,2.8 JP1.1
VDDA  (via drill 0.2, 0.3 pad 0.6)
  Top 0.2: IC3.1 25.55,4.7 25.4,4.7 25.2,4.5 C18.1 C22.1
  Top 0.254: IC3.27 24.15,9.55 v24.1,9.6 | 24.1,13.45 C21.1
  Top 0.406: C21.1 26.05,13.75 L2.1 | 24.1,13.45 v24.1,12.7 21.35,12.7 R34.2 | v23.7,5.6 C22.1 | R29.2 R32.2 R34.2 | R34.2 21.15,10.9 C13.1 21.15,10.7 R35.2
  Route15 0.406: v17.32,11.54 17.32,11.5 20.8,11.5 22,12.7 v24.1,12.7 v24.1,9.6 24.1,6 v23.7,5.6
  Bottom 0.406: X4.5 13.42,11.54 X4.4 v17.32,11.54 17.77,11.54 19,10.3 C24.1
VDDANA
  Top 0.125: IC1.C6 39.7,16.2 36.55,16.2 C45.1
  Top 0.406: L5.1 34.65,16.5 C42.1 C45.1
VDDBU  (via drill 0.2)
  Top 0.125: IC1.B5 v39.7,15.4
  Top 0.305: v38.1,6.6 37.35,6.6 R39.1
  Top 0.406: D1.3 R39.1
  Bottom 0.125: v39.7,15.4 41.5,15.4 42.5,14.4 42.5,9.2 40.4,7.1 38.3,7.1 38.1,6.9 v38.1,6.6
VDDOSC  (via drill 0.2)
  Top 0.2: IC1.T13 v50.9,22.6
  Bottom 0.2: v50.9,22.6 51,22.7 53.7,22.7 53.8,22.6 53.95,22.6 C43.1
  Bottom 0.406: C43.1 C40.1 57.35,22.45 L3.1
VDDPLLA  (via drill 0.2)
  Top 0.2: IC1.R12 v50.1,21
  Bottom 0.2: v50.1,21 53.75,21 C44.1
  Bottom 0.406: C44.1 C41.1 57.35,20.65 L4.1
WKUP  (via drill 0.2)
  Top 0.125: IC1.A7 v38.9,17
  Top 0.305: R39.2 38.55,8.05 38.8,7.8 v38.8,6.6
  Bottom 0.125: v38.9,17 40.1,15.8 41.6,15.8 42.9,14.5 42.9,9 40.6,6.7 38.9,6.7 v38.8,6.6

## Text on the board
Top: SAM9G25 Board | Layer 1 (top)
Route2: Layer 2 (GND)
Route15: Layer 3 (VDD)
Bottom: (c) eMicrotec - 2014 | Layer 4 (bottom)